# EAGLE design io (EAGLE 7.7.0)
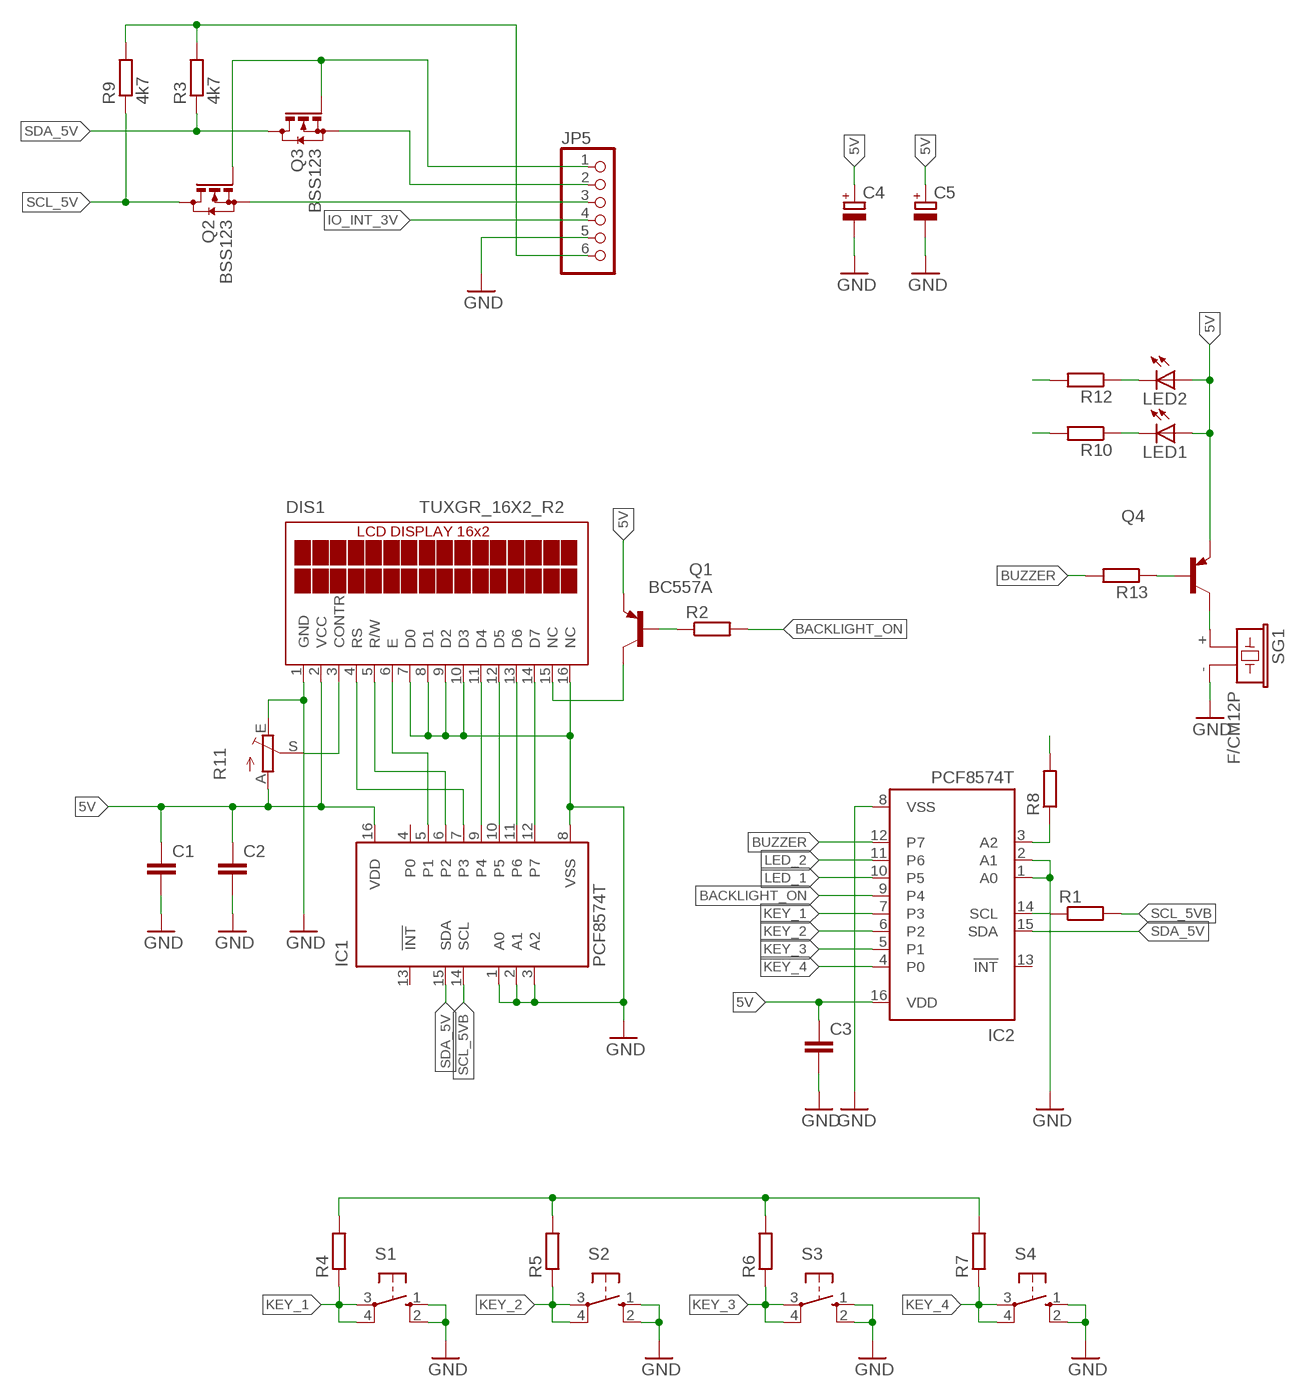
[diagram p0: schematic, sheet 1]

## Parts
C1  C-EUC1206  [C1206]
C2  C-EUC0603  [C0603]
C3  C-EUC1206  [C1206]
C4  CPOL-EUSMCD  [SMC_D]
C5  CPOL-EUSMCD  [SMC_D]
DIS1  TUXGR_16X2_R2  [TUXGR_16X2_R2]
IC1  PCF8574T  [SO16W]
IC2  PCF8574T  [SO16W]
JP5  PINHD-1X6  [1X06]
LED1  LED5MM  [LED5MM]
LED2  LED5MM  [LED5MM]
Q1  BC557A  [TO92-EBC]
Q2  BSS123  [SOT23]
Q3  BSS123  [SOT23]
Q4  BC557A-PNP-TO92-EBC  [TO92-EBC]
R1  R-EU_R0603  [R0603]
R2  R-EU_0204/5  [0204/5]
R3  4k7  R-EU_R0603  [R0603]
R4  R-EU_0204/7  [0204/7]
R5  R-EU_0204/7  [0204/7]
R6  R-EU_0204/5  [0204/5]
R7  R-EU_0204/5  [0204/5]
R8  R-EU_R0603  [R0603]
R9  4k7  R-EU_R1206  [R1206]
R10  R-EU_0204/5  [0204/5]
R11  TRIM_EU-B25U  [B25U]
R12  R-EU_0204/5  [0204/5]
R13  R-EU_R0603  [R0603]
S1  10-XX  [B3F-10XX]
S2  10-XX  [B3F-10XX]
S3  10-XX  [B3F-10XX]
S4  10-XX  [B3F-10XX]
SG1  F/CM12P  [F/CM12P]

## Nets
5V: C1.1 C2.1 C3.1 C4.+ C5.+ DIS1.2(VCC) IC1.16(VDD) IC2.16(VDD) JP5.6 LED1.A LED2.A Q1.E Q4.E R3.2 R4.2 R5.2 R6.2 R7.2 R8.2 R9.2 R11.A
_3V: JP5.1 Q2.1(G) Q3.1(G)
BACKLIGHT_ON: IC2.9(P4) R2.2
BUZZER: IC2.12(P7) R13.2
GND: C1.2 C2.2 C3.2 C4.- C5.- DIS1.1(GND) DIS1.7(D0) DIS1.8(D1) DIS1.9(D2) DIS1.10(D3) DIS1.16(NC) IC1.1(A0) IC1.2(A1) IC1.3(A2) IC1.8(VSS) IC2.1(A0) IC2.2(A1) IC2.8(VSS) JP5.5 R11.E S1.1(S) S1.2(S1) S2.1(S) S2.2(S1) S3.1(S) S3.2(S1) S4.1(S) S4.2(S1) SG1.-
IO_INT_3V: JP5.4
KEY_1: IC2.7(P3) R4.1 S1.3(P) S1.4(P1)
KEY_2: IC2.6(P2) R5.1 S2.3(P) S2.4(P1)
KEY_3: IC2.5(P1) R6.1 S3.3(P) S3.4(P1)
KEY_4: IC2.4(P0) R7.1 S4.3(P) S4.4(P1)
LED_1: IC2.10(P5) R10.2
LED_2: IC2.11(P6) R12.2
N$3: DIS1.14(D7) IC1.12(P7)
N$4: DIS1.13(D6) IC1.11(P6)
N$5: DIS1.12(D5) IC1.10(P5)
N$6: DIS1.11(D4) IC1.9(P4)
N$7: DIS1.6(E) IC1.5(P1)
N$8: DIS1.5(R/W) IC1.6(P2)
N$9: DIS1.4(RS) IC1.7(P3)
N$10: IC2.3(A2) R8.1
N$11: DIS1.15(NC) Q1.C
N$12: Q1.B R2.1
N$13: DIS1.3(CONTR) R11.S
N$14: LED1.K(C) R10.1
N$15: LED2.K(C) R12.1
N$16: Q4.C SG1.+
N$17: Q4.B R13.1
SCL_3V: JP5.3 Q2.2(S)
SCL_5V: IC2.14(SCL) Q2.3(D) R1.1 R9.1
SCL_5VB: IC1.14(SCL) R1.2
SDA_3V: JP5.2 Q3.2(S)
SDA_5V: IC1.15(SDA) IC2.15(SDA) Q3.3(D) R3.1
Unconnected: IC1.4(P0) IC1.13(!INT) IC2.13(!INT)

## Library data of the parts
C1-C3 = rcl:C-EU: CAPACITOR, European symbol
C4 C5 = rcl:CPOL-EU: POLARIZED CAPACITOR, European symbol
DIS1 = display-lcd:TUXGR_16X2_R2: Tuxgraphics LCD display 16x2 characters reflective, without background light Source: tuxgr_12x2_r2.pdf; OC_FARNELL: unknown; OC_NEWARK: unknown
IC1 IC2 = micro-philips:PCF8574: I2C-Bus Remote 8-bit I/O expander http://www.semiconductors.philips.com/acrobat_download/datasheets/PCF8574_4.pdf; MPN: PCF8574T/3,512; OC_FARNELL: 1201255; OC_NEWARK: 70R6870
JP5 = pinhead:PINHD-1X6: PIN HEADER
LED1 LED2 = led:LED: LED OSRAM: - CHIPLED LG R971, LG N971, LY N971, LG Q971, LY Q971, LO R971, LY R971 LH N974, LH R974 LS Q976, LO Q976, LY Q976 LO Q996 - Hyper CHIPLED LW Q18S LB Q993, LB Q99A, LB R99A - SideLED LS A670, LO A670, LY A670, LG A670, LP A670 LB A673, LV A673, LT A673, LW A673 LH A674 LY A675 LS A676, LA A676, LO A676, LY A676, LW A676 LS A679, LY A679, LG A679 - Hyper Micro SIDELED® LS Y876, LA Y876, LO Y876, LY Y876 LT Y87S - SmartLED LW L88C, LW L88S LB L89C, LB L89S, LG L890 LS L89K, LO L89K, LY L89K LS L896, LA L896, LO L896, LY L896 - TOPLED LS T670, LO T670, LY T670, LG T670, LP T670 LSG T670, LSP T670, LSY T670, LOP T670, LYG T670 LG T671, LOG T671, LSG T671 LB T673, LV T673, LT T673, LW T673 LH T674 LS T676, LA T676, LO T676, LY T676, LB T676, LH T676, LSB T676, LW T676 LB T67C, LV T67C, LT T67C, LS T67K, LO T67K, LY T67K, LW E67C LS E67B, LA E67B, LO E67B, LY E67B, LB E67C, LV E67C, LT E67C LW T67C LS T679, LY T679, LG T679 LS T770, LO T770, LY T770, LG T770, LP T770 LB T773, LV T773, LT T773, LW T773 LH T774 LS E675, LA E675, LY E675, LS T675 LS T776, LA T776, LO T776, LY T776, LB T776 LHGB T686 LT T68C, LB T68C - Hyper Mini TOPLED® LB M676 - Mini TOPLED Santana® LG M470 LS M47K, LO M47K, LY M47K Source: http://www.osram.convergy.de LUXEON: - LUMILED® LXK2-PW12-R00, LXK2-PW12-S00, LXK2-PW14-U00, LXK2-PW14-V00 LXK2-PM12-R00, LXK2-PM12-S00, LXK2-PM14-U00 LXK2-PE12-Q00, LXK2-PE12-R00, LXK2-PE12-S00, LXK2-PE14-T00, LXK2-PE14-U00 LXK2-PB12-K00, LXK2-PB12-L00, LXK2-PB12-M00, LXK2-PB14-N00, LXK2-PB14-P00, LXK2-PB14-Q00 LXK2-PR12-L00, LXK2-PR12-M00, LXK2-PR14-Q00, LXK2-PR14-R00 LXK2-PD12-Q00, LXK2-PD12-R00, LXK2-PD12-S00 LXK2-PH12-R00, LXK2-PH12-S00 LXK2-PL12-P00, LXK2-PL12-Q00, LXK2-PL12-R00 Source: www.luxeon.com KINGBRIGHT: KA-3528ASYC Source: www.kingbright.com
Q1 = transistor-pnp:BC557*: PNP Transistror
Q2 Q3 = transistor-small-signal:BSS123: N-CHANNEL MOS FET
Q4 = transistor:*-PNP-: PNP Transistror
R1-R10 R12 R13 = rcl:R-EU_: RESISTOR, European symbol
R11 = pot:TRIM_EU-: POTENTIOMETER
S1-S4 = switch-omron:10-XX: OMRON SWITCH; MPN: B3F-1000; OC_FARNELL: 176432; OC_NEWARK: 36M3542
SG1 = buzzer:F/CM12P: BUZZER Source: Buerklin; OC_FARNELL: unknown; OC_NEWARK: unknown

## Board
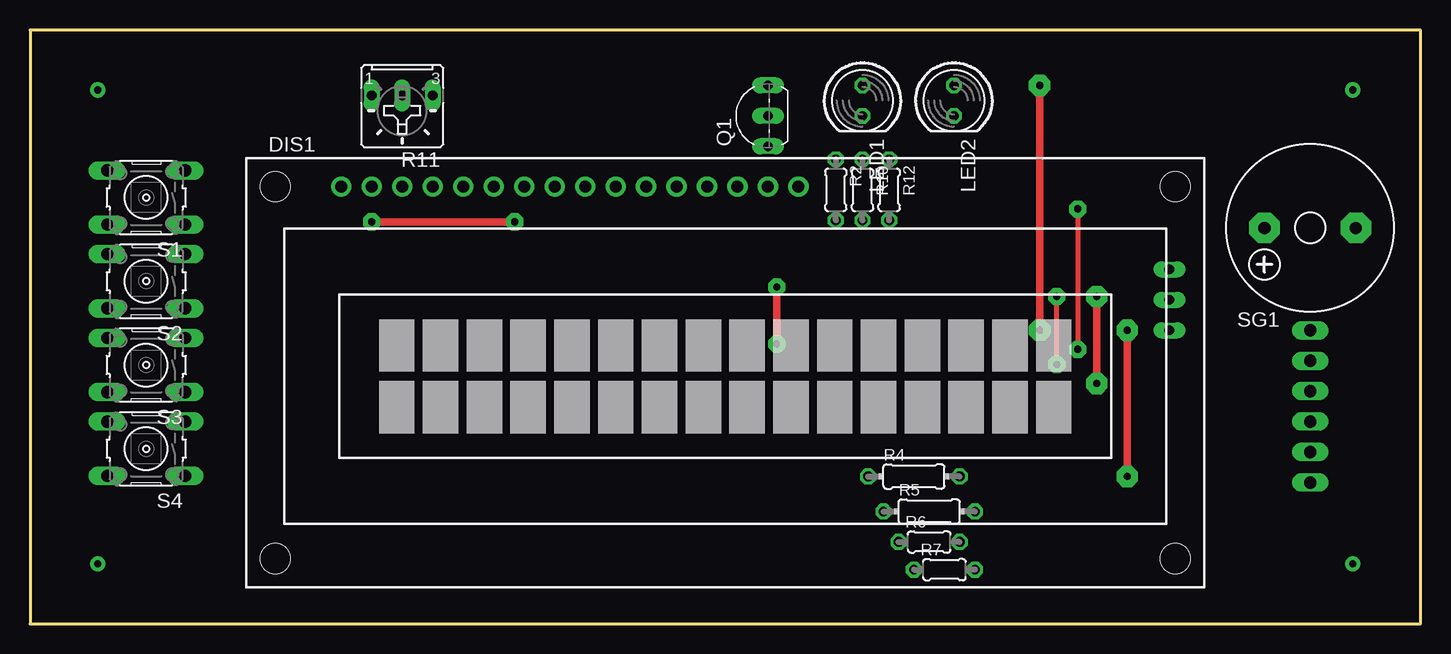
[diagram p1: board, top side]
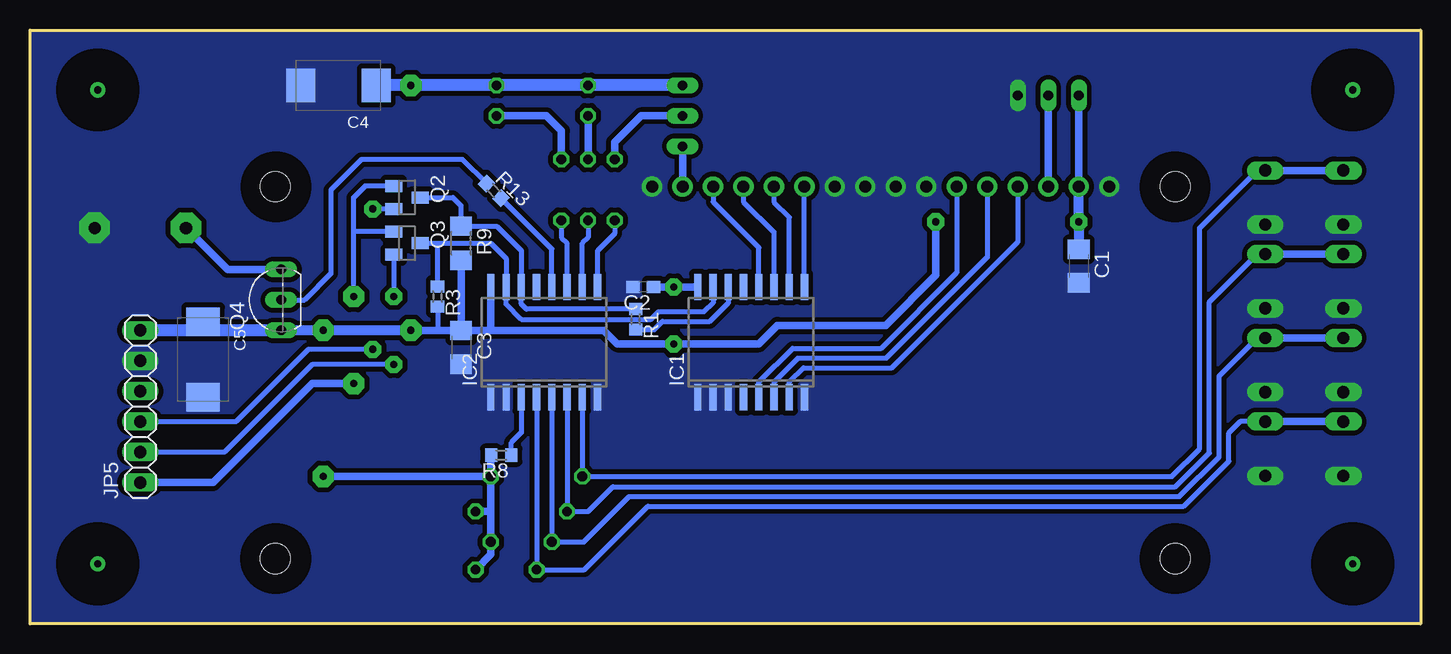
[diagram p2: board, bottom side, seen from below]

Size 115.88 x 49.53 mm. Coordinates in mm from the lower left corner, seen from the top.
Outline: 0,0 115.88,0 115.88,49.53 0,49.53 0,0
Copper layers (1*16): Top 0.035mm / dielectric 1.5mm / Bottom 0.035mm
Design rules "default *": minimum track width 10mil, minimum drill 24mil, track to track 8mil, track to pad 8mil, pad to pad 8mil, via to via 8mil, smd to smd 8mil, copper to edge 0mil, drill to drill 8mil, minimum pad ring 10mil, minimum via ring 8mil, stop-mask expansion 4mil, vias tented up to drill 0mil, thermal gap 10mil
tRestrict: area 2.6,2 to 8.7,8; area 2.6,41.5 to 8.7,47.6; area 107.2,41.5 to 113.3,47.6; area 107.2,2 to 113.3,8
bRestrict: area 2.6,2 to 8.7,8; area 2.6,41.5 to 8.7,47.6; area 107.2,41.5 to 113.3,47.6; area 107.2,2 to 113.3,8; area 17.9,33.9 to 23,39; area 17.9,2.9 to 23,8; area 92.9,2.9 to 97.9,8; area 92.8,33.9 to 97.9,39

### Footprints (pad centres in the part's own frame; a part is rotated, then mirrored left to right if it is on the bottom)
C1206 = smd 1.6 x 1.8: 1 -1.4,0; 2 1.4,0
C0603 = smd 1.1 x 1: 1 -0.85,0; 2 0.85,0
SMC_D = smd 2.4 x 2.8: + -3.15,0; - 3.15,0
TUXGR_16X2_R2 = drill 1 pad 1.676: 1 -32,15.5; 2 -29.46,15.5; 3 -26.92,15.5; 4 -24.38,15.5; 5 -21.84,15.5; 6 -19.3,15.5; 7 -16.76,15.5; 8 -14.22,15.5; 9 -11.68,15.5; 10 -9.14,15.5; 11 -6.6,15.5; 12 -4.06,15.5; 13 -1.52,15.5; 14 1.02,15.5; 15 3.56,15.5; 16 6.1,15.5 | hole 2.5: -37.5,-15.5; 37.5,-15.5; -37.5,15.5; 37.5,15.5
SO16W = smd 0.6 x 2.2: 1 -4.445,-4.6; 2 -3.175,-4.6; 3 -1.905,-4.6; 4 -0.635,-4.6; 5 0.635,-4.6; 6 1.905,-4.6; 7 3.175,-4.6; 8 4.445,-4.6; 9 4.445,4.6; 10 3.175,4.6; 11 1.905,4.6; 12 0.635,4.6; 13 -0.635,4.6; 14 -1.905,4.6; 15 -3.175,4.6; 16 -4.445,4.6
1X06 = drill 1.016 long: 1 -6.35,0; 2 -3.81,0; 3 -1.27,0; 4 1.27,0; 5 3.81,0; 6 6.35,0
LED5MM = drill 0.813 octagon: A -1.27,0; K 1.27,0
TO92-EBC = drill 0.813 long: B 0,-1.27; C -2.54,-1.27; E 2.54,-1.27
SOT23 = smd 1 x 1.4: 1 -0.95,-1.1; 2 0.95,-1.1; 3 0,1.1
TO92-EBC' = drill 0.813 long: B 0,-1.27; C 2.54,-1.27; E -2.54,-1.27
R0603 = smd 1 x 1.1: 1 -0.85,0; 2 0.85,0
0204/5 = drill 0.813 octagon: 1 -2.54,0; 2 2.54,0
0204/7 = drill 0.813 octagon: 1 -3.81,0; 2 3.81,0
R1206 = smd 1.6 x 1.803: 1 -1.422,0; 2 1.422,0
B25U = drill 0.813 long: A 2.54,-0.889; E -2.54,-0.889; S 0,-0.889
B3F-10XX = drill 1.016 long: 1 -3.251,2.261; 2 3.251,2.261; 3 -3.251,-2.261; 4 3.251,-2.261
F/CM12P = drill 1.016 pad 2.54 octagon: + 3.81,0; - -3.81,0

### Placement (x,y rotation side)
C1  28.48,29.85 270 bottom
C2  64.77,28.1 180 bottom
C3  79.95,23.06 270 bottom
C4  90.17,44.91 180 bottom
C5  101.45,22.05 270 bottom
DIS1  57.94,20.95 0 top
IC1  55.78,23.49 0 bottom
IC2  73.03,23.49 0 bottom
JP5  106.68,18.14 90 bottom
LED1  69.37,43.64 270 top
LED2  76.99,43.64 270 top
Q1  60.23,42.37 90 top
Q2  84.45,35.56 270 bottom
Q3  84.45,31.75 270 bottom
Q4  [TO92-EBC']  96.22,27.03 90 bottom
R1  65.41,25.4 270 bottom
R2  67.15,36.2 270 top
R3  81.92,27.3 270 bottom
R4  73.66,12.29 0 top
R5  74.93,9.37 0 top
R6  74.93,6.83 0 top
R7  76.2,4.52 0 top
R8  76.61,14.07 180 bottom
R9  79.95,31.75 270 bottom
R10  69.37,36.2 270 top
R11  31.01,43.18 180 top
R12  71.6,36.2 270 top
R13  77.23,36.12 315 bottom
S1  9.68,35.56 180 top
S2  9.68,28.57 180 top
S3  9.68,21.59 180 top
S4  9.68,14.61 180 top
SG1  106.68,33.02 180 top

### Tracks (layer width: path | path; a pad name or v marks a point on that pad's centre or on a via)
5V  (via drill 0.6 pad 1.42, 0.6 pad 1.78)
  Top 0.61: v62.23,28.1 v62.23,23.34 | v40.39,33.53 v28.48,33.53 | v91.44,24.49 v91.44,12.29 | v84.14,24.49 v84.14,44.91
  Bottom 0.406: C3.1 80.01,24.48 80.01,24.49 | R3.2 81.92,24.49
  Bottom 0.61: IC1.16 v62.23,28.1 C2.1 | 77.47,24.49 68.07,24.49 66.93,23.34 v62.23,23.34 55.14,23.34 53.59,24.89 44.58,24.89 40.39,29.08 v40.39,33.53 | IC2.16 77.47,24.49 | R11.A DIS1.2 | 77.47,24.49 80.01,24.49 81.92,24.49 v84.14,24.49 | R9.2 C3.1 | R8.2 77.47,14.06 R4.2 | R4.2 77.47,9.52 | 77.47,9.52 R6.2 77.47,5.79 R7.2 | R5.2 77.62,9.37 77.47,9.52 | v91.44,12.29 R4.2
  Bottom 0.813: DIS1.2 v28.48,33.53 C1.1 | v84.14,24.49 v91.44,24.49 Q4.E
  Bottom 1.016: Q1.E LED1.A LED2.A v84.14,44.91 C4.+ | Q4.E 101.6,24.49 | 101.6,24.49 102.23,24.49 | 102.23,24.49 JP5.6 | 102.25,24.5 102.23,24.49 | C5.+ 101.45,24.64 101.6,24.49
_3V  (via drill 0.6 pad 1.78)
  Top 0.61: v88.9,20.04 v88.9,27.3
  Bottom 0.406: v88.9,27.3 88.9,32.7 | 88.9,32.7 88.9,35.56 87.95,36.51 Q2.1 | Q3.1 88.9,32.7
  Bottom 0.61: v88.9,20.04 92.35,20.04 100.61,11.79 JP5.1
BACKLIGHT_ON
  Bottom 0.406: IC2.9 68.58,31.11 67.15,32.54 R2.2
BUZZER
  Bottom 0.406: IC2.12 72.39,31.28 R13.2
GND
  pour Bottom (isolate 0.406, no thermals): 0,49.53 0,0 115.88,0 115.88,49.53
KEY_1
  Bottom 0.406: IC2.7 R4.1 20.73,12.29 18.41,14.61 18.41,33.02 13.61,37.82 S1.3
  Bottom 0.61: S1.4 S1.3
KEY_2
  Bottom 0.406: IC2.6 R5.1 69.37,9.37 67.31,11.43 20.42,11.43 17.6,14.25 17.6,26.85 13.61,30.84 S2.3
  Bottom 0.61: S2.4 S2.3
KEY_3
  Bottom 0.406: IC2.5 R6.1 69.72,6.83 65.94,10.62 20.09,10.62 16.79,13.92 16.79,20.68 13.61,23.85 S3.3
  Bottom 0.61: S3.4 S3.3
KEY_4
  Bottom 0.406: IC2.4 R7.1 | R7.1 | R7.1 69.67,4.52 64.39,9.8 19.74,9.8 15.98,13.56 15.98,15.93 15.04,16.87 S4.3
  Bottom 0.61: S4.3 S4.4
LED_1
  Bottom 0.406: IC2.10 69.85,31.75 69.37,32.23 R10.2
LED_2
  Bottom 0.406: IC2.11 71.12,31.75 71.6,32.23 R12.2
N$1  (via drill 0.6 pad 1.27)
  other vias: 5.63,44.53
N$2  (via drill 0.6 pad 1.27)
  other vias: 5.63,5
N$3
  Bottom 0.406: IC1.12 55.14,31.37 58.96,35.19 DIS1.14
N$4
  Bottom 0.406: IC1.11 53.87,32.64 56.42,35.19 DIS1.13
N$5
  Bottom 0.406: IC1.10 52.6,33.91 53.88,35.19 DIS1.12
N$6
  Bottom 0.406: IC1.9 DIS1.11
N$7
  Bottom 0.406: DIS1.6 38.64,29.31 44.96,22.99 52.32,22.99 55.14,20.17 IC1.5
N$8
  Bottom 0.406: DIS1.5 36.1,30.58 44.5,22.17 51.87,22.17 53.87,20.17 IC1.6
N$9
  Bottom 0.406: DIS1.4 33.56,31.85 44.04,21.36 51.41,21.36 52.6,20.17 IC1.7
N$10
  Bottom 0.406: IC2.3 74.93,15.95 75.76,15.12 R8.1
N$11
  Bottom 0.61: Q1.C DIS1.15
N$12
  Bottom 0.61: R2.1 67.15,40.16 64.95,42.37 Q1.B
N$13
  Bottom 0.61: R11.S DIS1.3
N$14
  Bottom 0.61: R10.1 LED1.K
N$15
  Bottom 0.61: R12.1 71.6,41.12 72.85,42.37 LED2.K
N$16
  Bottom 0.61: Q4.C 99.42,29.57 SG1.+
N$17
  Bottom 0.406: R13.1 79.85,38.73 88.27,38.73 90.81,36.2 90.81,29.21 92.99,27.03 Q4.B
N$36  (via drill 0.6 pad 1.27)
  other vias: 5.63,44.53
N$37  (via drill 0.6 pad 1.27)
  other vias: 5.63,5
N$38  (via drill 0.6 pad 1.27)
  other vias: 110.24,5
N$39  (via drill 0.6 pad 1.27)
  other vias: 110.24,44.53
SCL_3V  (via drill 0.6 pad 1.42)
  Top 0.406: v87.31,34.61 v87.31,22.9
  Bottom 0.406: Q2.2 v87.31,34.61 | v87.31,22.9 92.67,22.9 98.7,16.87 JP5.3
SCL_5V
  Bottom 0.406: R1.1 74.51,26.25 74.93,26.67 IC2.14 74.93,31.11 76.99,33.17 R9.1 79.95,34.86 80.64,35.56 Q2.3
SCL_5VB
  Bottom 0.406: IC1.14 57.68,26.77 59.23,25.22 63.17,25.22 63.84,24.55 R1.2
SDA_3V  (via drill 0.6 pad 1.42)
  Top 0.406: v85.56,21.63 v85.56,27.3
  Bottom 0.406: Q3.2 v85.56,27.3 | v85.56,21.63 92.35,21.63 99.66,14.33 JP5.2
SDA_5V
  Bottom 0.406: IC1.15 58.95,26.77 59.69,26.04 63.5,26.04 64.14,25.4 74.93,25.4 76.2,26.67 IC2.15 76.2,30.48 77.47,31.75 81.92,31.75 | Q3.3 81.92,31.75 | R3.1 81.92,31.75